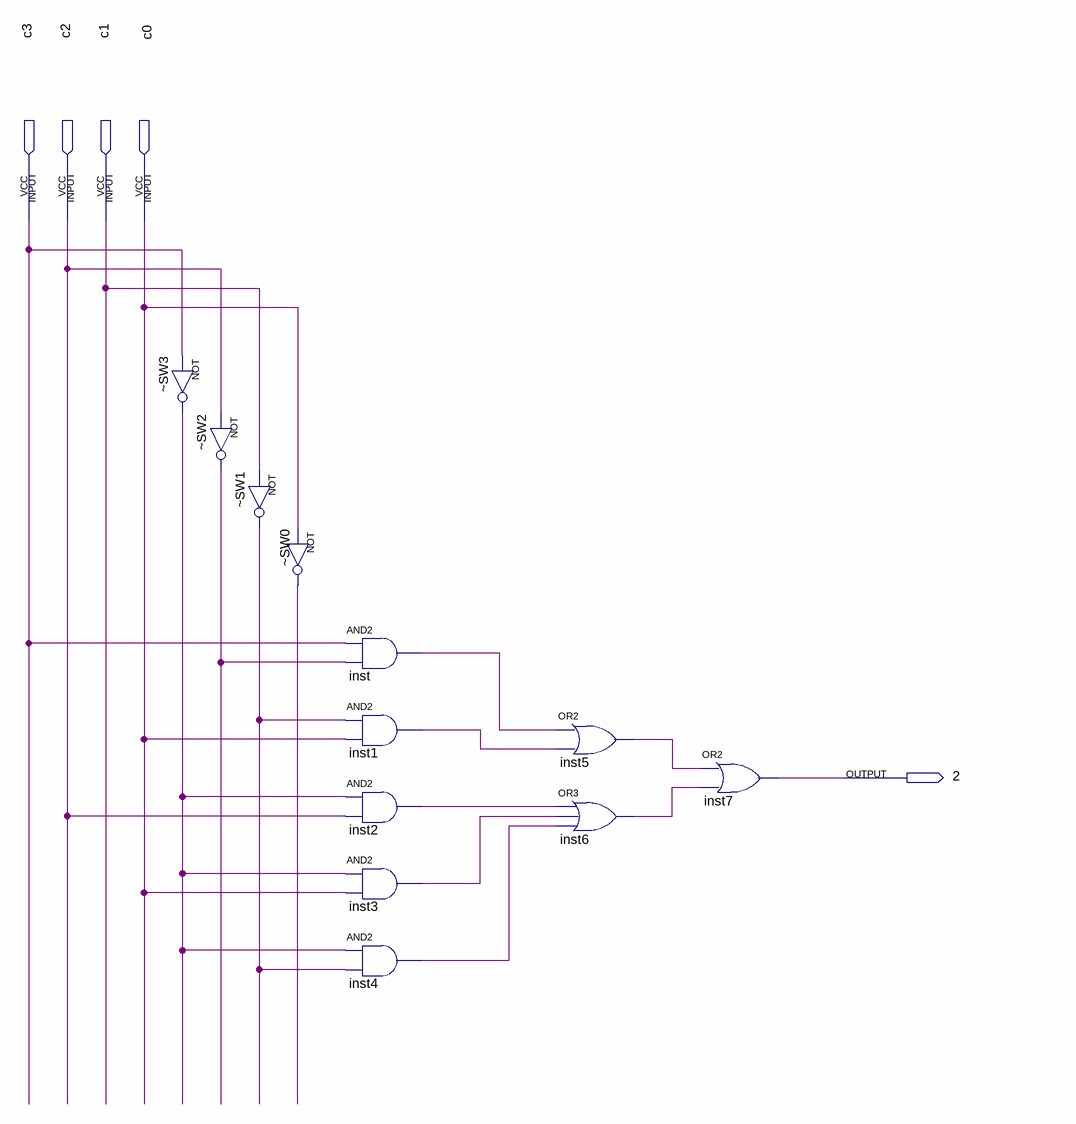
[diagram p0: schematic sheet]
// Quartus schematic 2.bdf as structural Verilog: 12 symbols, 5 pins
module \2  (
  input  c3,
  input  c2,
  input  c1,
  input  c0,
  output \2 
);

  wire _SW0_out, _SW1_out, _SW2_out, _SW3_out, inst1_out, inst2_out, inst3_out, inst4_out, inst5_out,
       inst6_out, inst_out;

  not \u_~SW3  (_SW3_out, c3);
  not \u_~SW2  (_SW2_out, c2);
  not \u_~SW1  (_SW1_out, c1);
  not \u_~SW0  (_SW0_out, c0);
  and inst (inst_out, c3, _SW2_out);
  and inst1 (inst1_out, _SW1_out, c0);
  and inst2 (inst2_out, _SW3_out, c2);
  and inst3 (inst3_out, _SW3_out, c0);
  and inst4 (inst4_out, _SW3_out, _SW1_out);
  or inst5 (inst5_out, inst_out, inst1_out);
  or inst6 (inst6_out, inst2_out, inst3_out, inst4_out);
  or inst7 (\2 , inst5_out, inst6_out);
endmodule
